# EAGLE design WIMOS-motherboard (EAGLE 7.7.0)
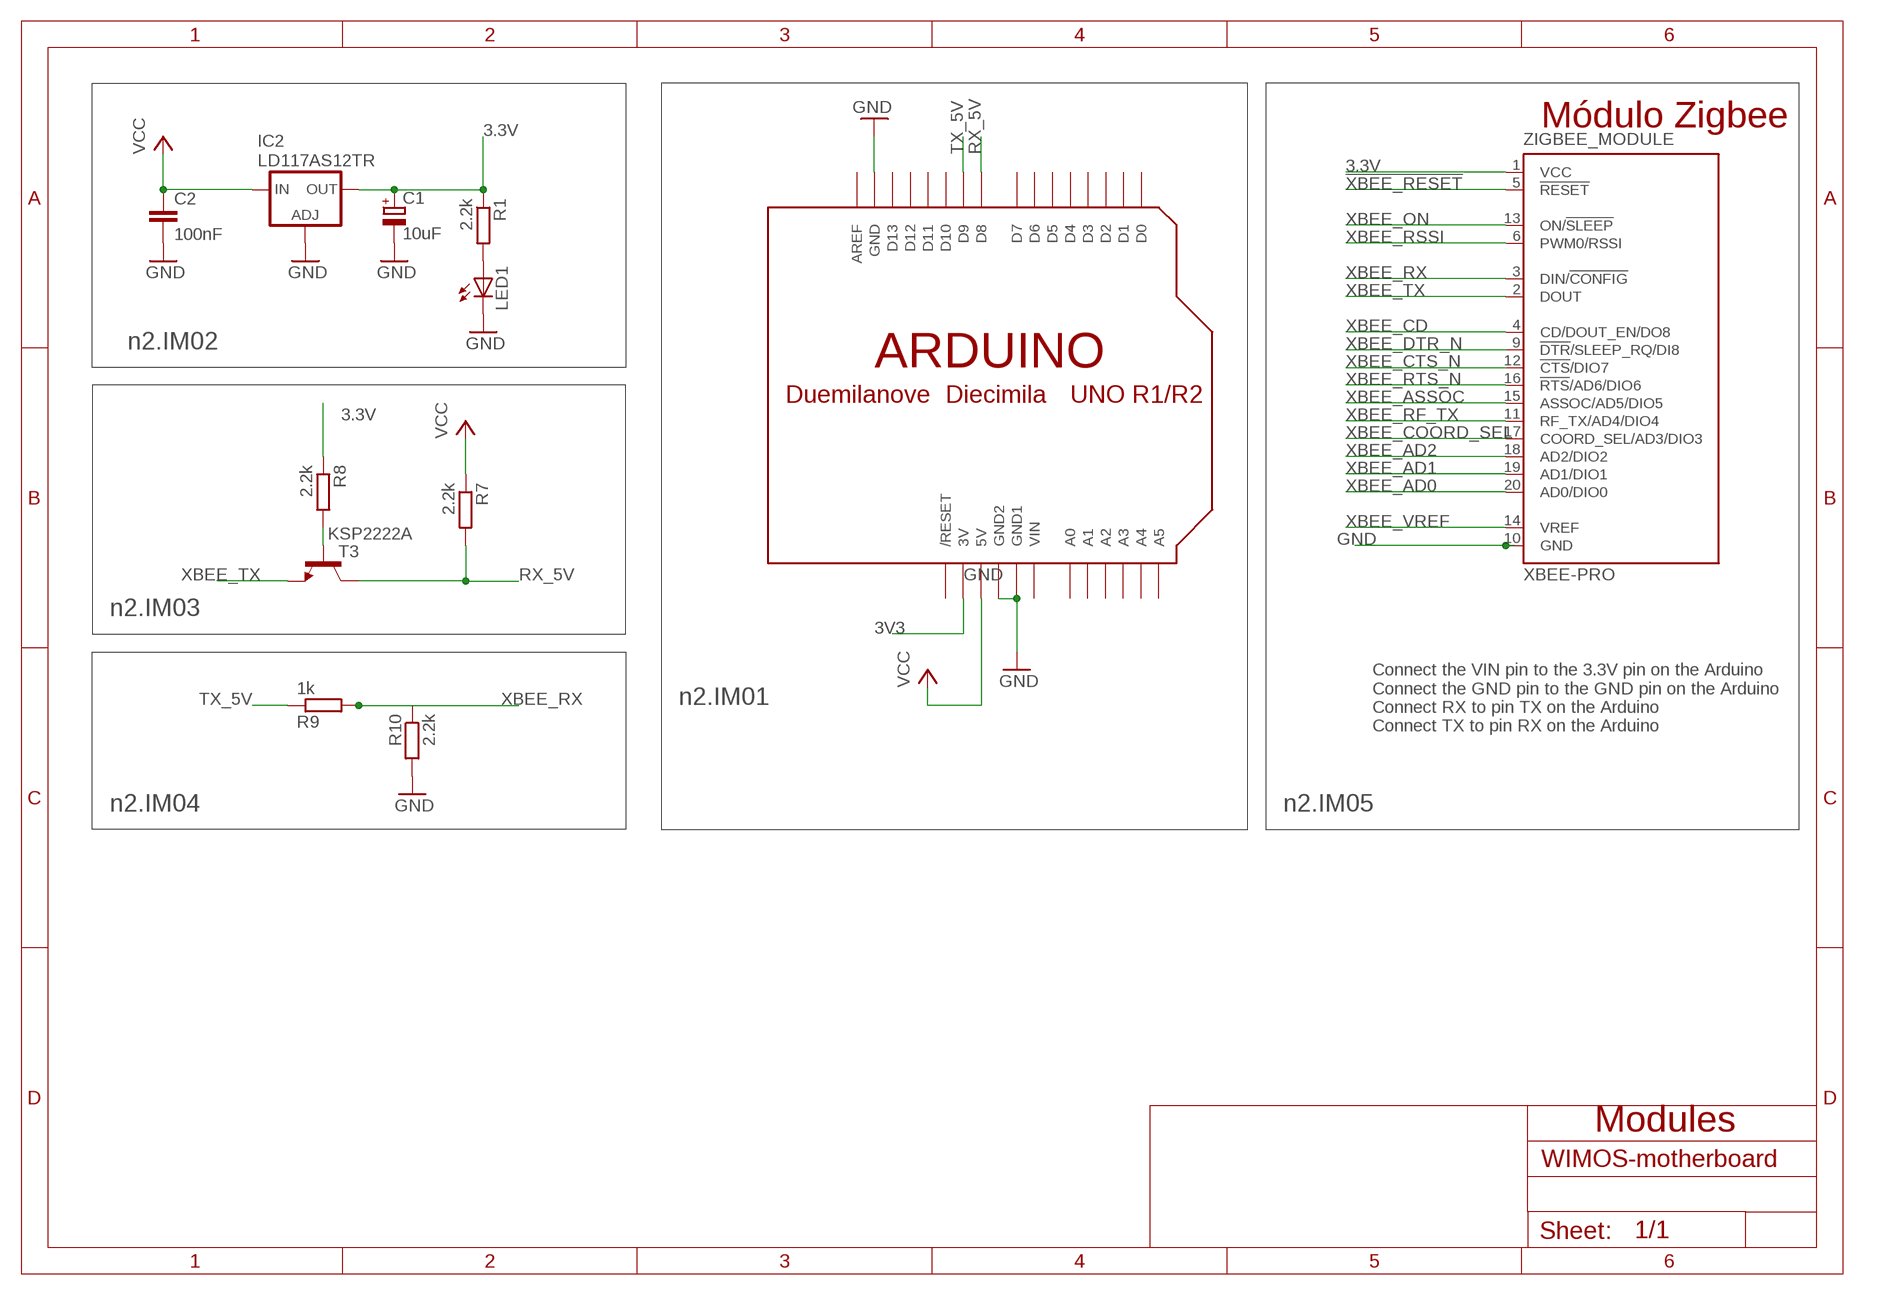
[diagram p0: schematic, sheet 1]

## Parts
C1  10uF  CPOL-EU153CLV-0810  [153CLV-0810]
C2  100nF  C-EUC0805K  [C0805K]
IC2  LD117AS12TR  [SOT223]
LED1  LED5MM  [LED5MM]
R1  2.2k  R-EU_R0805  [R0805]
R7  2.2k  R-EU_0204/5  [0204/5]
R8  2.2k  R-EU_0204/5  [0204/5]
R9  1k  R-EU_0204/5  [0204/5]
R10  2.2k  R-EU_0204/5  [0204/5]
T3  KSP2222A  MPS2222A-NPN-TO92-CBE  [TO92-CBE]
U$1  ARDUINO-NODIM  [ARDUINO-NODIM]
ZIGBEE_MODULE  XBEE-PRO  [XBEE-PRO]

## Nets
3.3V: C1.+ IC2.4(OUT) R1.1 R8.1 ZIGBEE_MODULE.1(VCC)
3V3: U$1.3V
!XBEE_RESET: ZIGBEE_MODULE.5(!RESET)
GND [gnd]: C1.- C2.2 IC2.1(ADJ) LED1.K(C) R10.2 U$1.GND U$1.GND1 U$1.GND2 ZIGBEE_MODULE.10(GND)
N$1: LED1.A R1.2
N$4: R8.2 T3.B
RX_5V: R7.2 T3.C U$1.D8
TX_5V: R9.1 U$1.D9
VCC: C2.1 IC2.3(IN) R7.1 U$1.5V
XBEE_AD0: ZIGBEE_MODULE.20(AD0/DIO0)
XBEE_AD1: ZIGBEE_MODULE.19(AD1/DIO1)
XBEE_AD2: ZIGBEE_MODULE.18(AD2/DIO2)
XBEE_ASSOC: ZIGBEE_MODULE.15(ASSOC/AD5/DIO5)
XBEE_CD: ZIGBEE_MODULE.4(CD/DOUT_EN/DO8)
XBEE_COORD_SEL: ZIGBEE_MODULE.17(COORD_SEL/AD3/DIO3)
XBEE_CTS_N: ZIGBEE_MODULE.12(!CTS!/DIO7)
XBEE_DTR_N: ZIGBEE_MODULE.9(!DTR!/SLEEP_RQ/DI8)
XBEE_ON: ZIGBEE_MODULE.13(ON/!SLEEP)
XBEE_RF_TX: ZIGBEE_MODULE.11(RF_TX/AD4/DIO4)
XBEE_RSSI: ZIGBEE_MODULE.6(PWM0/RSSI)
XBEE_RTS_N: ZIGBEE_MODULE.16(!RTS!/AD6/DIO6)
XBEE_RX: R9.2 R10.1 ZIGBEE_MODULE.3(DIN/!CONFIG)
XBEE_TX: T3.E ZIGBEE_MODULE.2(DOUT)
XBEE_VREF: ZIGBEE_MODULE.14(VREF)
Unconnected: U$1.A0 U$1.A1 U$1.A2 U$1.A3 U$1.A4 U$1.A5 U$1.AREF U$1.D0 U$1.D1 U$1.D2 U$1.D3 U$1.D4 U$1.D5 U$1.D6 U$1.D7 U$1.D10 U$1.D11 U$1.D12 U$1.D13 U$1.RESET(/RESET)

## Notes on the sheet
- Módulo Zigbee
- n2.IM02
- n2.IM03
- n2.IM01
- Connect the VIN pin to the 3.3V pin on the Arduino
  Connect the GND pin to the GND pin on the Arduino
  Connect RX to pin TX on the Arduino
  Connect TX to pin RX on the Arduino
- n2.IM04 | n2.IM05
- Modules

## Power pins joined to a net without a drawn wire
VIN: U$1.VIN

## Library data of the parts
C1 = rcl:CPOL-EU: POLARIZED CAPACITOR, European symbol
C2 = resistor:C-EU: CAPACITOR, European symbol
IC2 = v-reg:LD117A?*: Low drop fixed and adjustable positive voltage regulators 1 A Source: http://www.st.com/stonline/products/literature/ds/7194/ld1117axx.pdf
LED1 = led:LED: LED OSRAM: - CHIPLED LG R971, LG N971, LY N971, LG Q971, LY Q971, LO R971, LY R971 LH N974, LH R974 LS Q976, LO Q976, LY Q976 LO Q996 - Hyper CHIPLED LW Q18S LB Q993, LB Q99A, LB R99A - SideLED LS A670, LO A670, LY A670, LG A670, LP A670 LB A673, LV A673, LT A673, LW A673 LH A674 LY A675 LS A676, LA A676, LO A676, LY A676, LW A676 LS A679, LY A679, LG A679 - Hyper Micro SIDELED® LS Y876, LA Y876, LO Y876, LY Y876 LT Y87S - SmartLED LW L88C, LW L88S LB L89C, LB L89S, LG L890 LS L89K, LO L89K, LY L89K LS L896, LA L896, LO L896, LY L896 - TOPLED LS T670, LO T670, LY T670, LG T670, LP T670 LSG T670, LSP T670, LSY T670, LOP T670, LYG T670 LG T671, LOG T671, LSG T671 LB T673, LV T673, LT T673, LW T673 LH T674 LS T676, LA T676, LO T676, LY T676, LB T676, LH T676, LSB T676, LW T676 LB T67C, LV T67C, LT T67C, LS T67K, LO T67K, LY T67K, LW E67C LS E67B, LA E67B, LO E67B, LY E67B, LB E67C, LV E67C, LT E67C LW T67C LS T679, LY T679, LG T679 LS T770, LO T770, LY T770, LG T770, LP T770 LB T773, LV T773, LT T773, LW T773 LH T774 LS E675, LA E675, LY E675, LS T675 LS T776, LA T776, LO T776, LY T776, LB T776 LHGB T686 LT T68C, LB T68C - Hyper Mini TOPLED® LB M676 - Mini TOPLED Santana® LG M470 LS M47K, LO M47K, LY M47K Source: http://www.osram.convergy.de LUXEON: - LUMILED® LXK2-PW12-R00, LXK2-PW12-S00, LXK2-PW14-U00, LXK2-PW14-V00 LXK2-PM12-R00, LXK2-PM12-S00, LXK2-PM14-U00 LXK2-PE12-Q00, LXK2-PE12-R00, LXK2-PE12-S00, LXK2-PE14-T00, LXK2-PE14-U00 LXK2-PB12-K00, LXK2-PB12-L00, LXK2-PB12-M00, LXK2-PB14-N00, LXK2-PB14-P00, LXK2-PB14-Q00 LXK2-PR12-L00, LXK2-PR12-M00, LXK2-PR14-Q00, LXK2-PR14-R00 LXK2-PD12-Q00, LXK2-PD12-R00, LXK2-PD12-S00 LXK2-PH12-R00, LXK2-PH12-S00 LXK2-PL12-P00, LXK2-PL12-Q00, LXK2-PL12-R00 Source: www.luxeon.com KINGBRIGHT: KA-3528ASYC Source: www.kingbright.com
R1 R7-R10 = rcl:R-EU_: RESISTOR, European symbol
T3 = transistor:*-NPN-: NPN Transistror BF959 corrected 2008.03.06
U$1 = adafruit:ARDUINO: Arduino Diecimila/Duemilanove Make a shield with ease, this package has all the named pins as well as the two mounting drill holes and an outline of the USB and DC power connector. The outline is on the DIMENSION layer, so if your board house uses it they will cut the outline to match. http://www.ladyada.net/library/pcb/eaglelibrary.html
ZIGBEE_MODULE = maxstream:XBEE: XBee (TM) /XBee-PRO(TM) OEM RF Modules Source: MaxStream, Inc. xbee_productmanual.pdf; MPN: XBP24-AWI-001; OC_FARNELL: 1337916; OC_NEWARK: 42M2667

## Module INPUT
Ports: 

### Library data of the parts

## Net classes
0 default: width 0.203 mm, drill 0.406 mm, clearance 0.203 mm
1 USB: width 0.203 mm, drill 0.406 mm, clearance 0.203 mm
2 gnd: width 0.203 mm, drill 0.406 mm, clearance 0.203 mm
3 usbvcc: width 0.203 mm, drill 0.406 mm, clearance 0.203 mm
4 USBpair: width 0.254 mm, drill 0.406 mm, clearance 0.61 mm

## Board
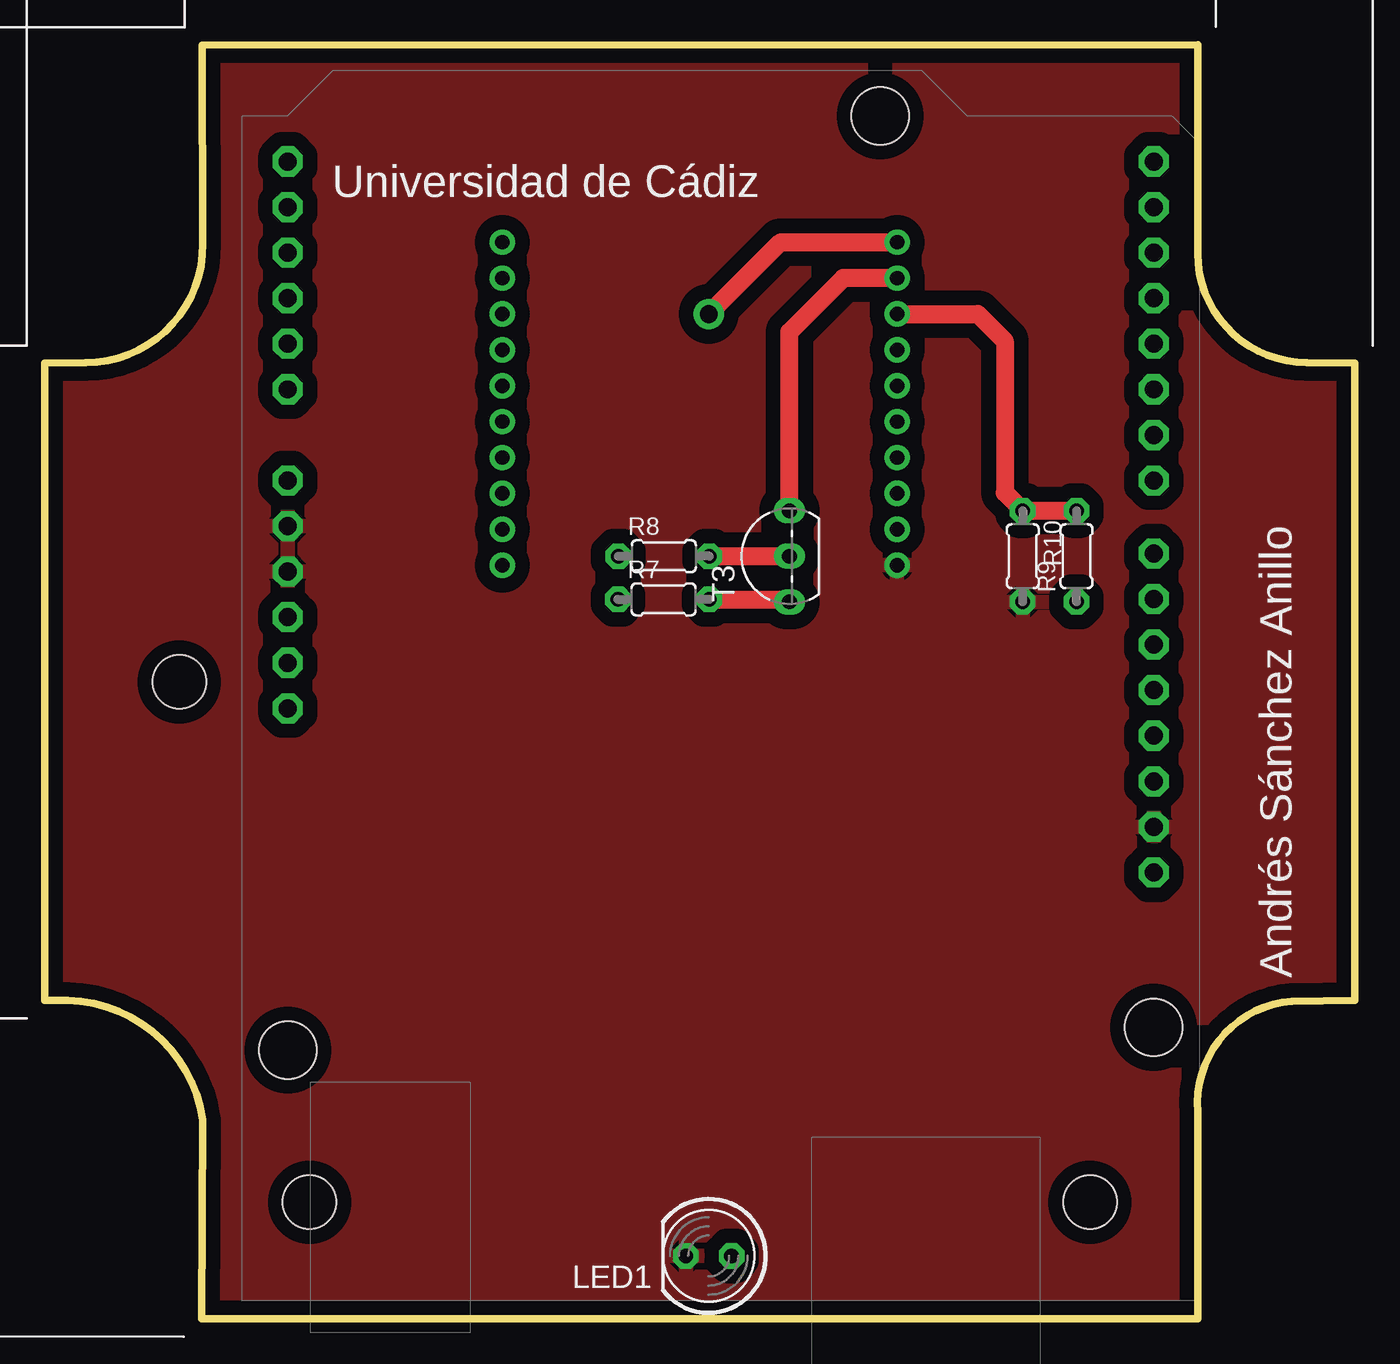
[diagram p1: board, top side]
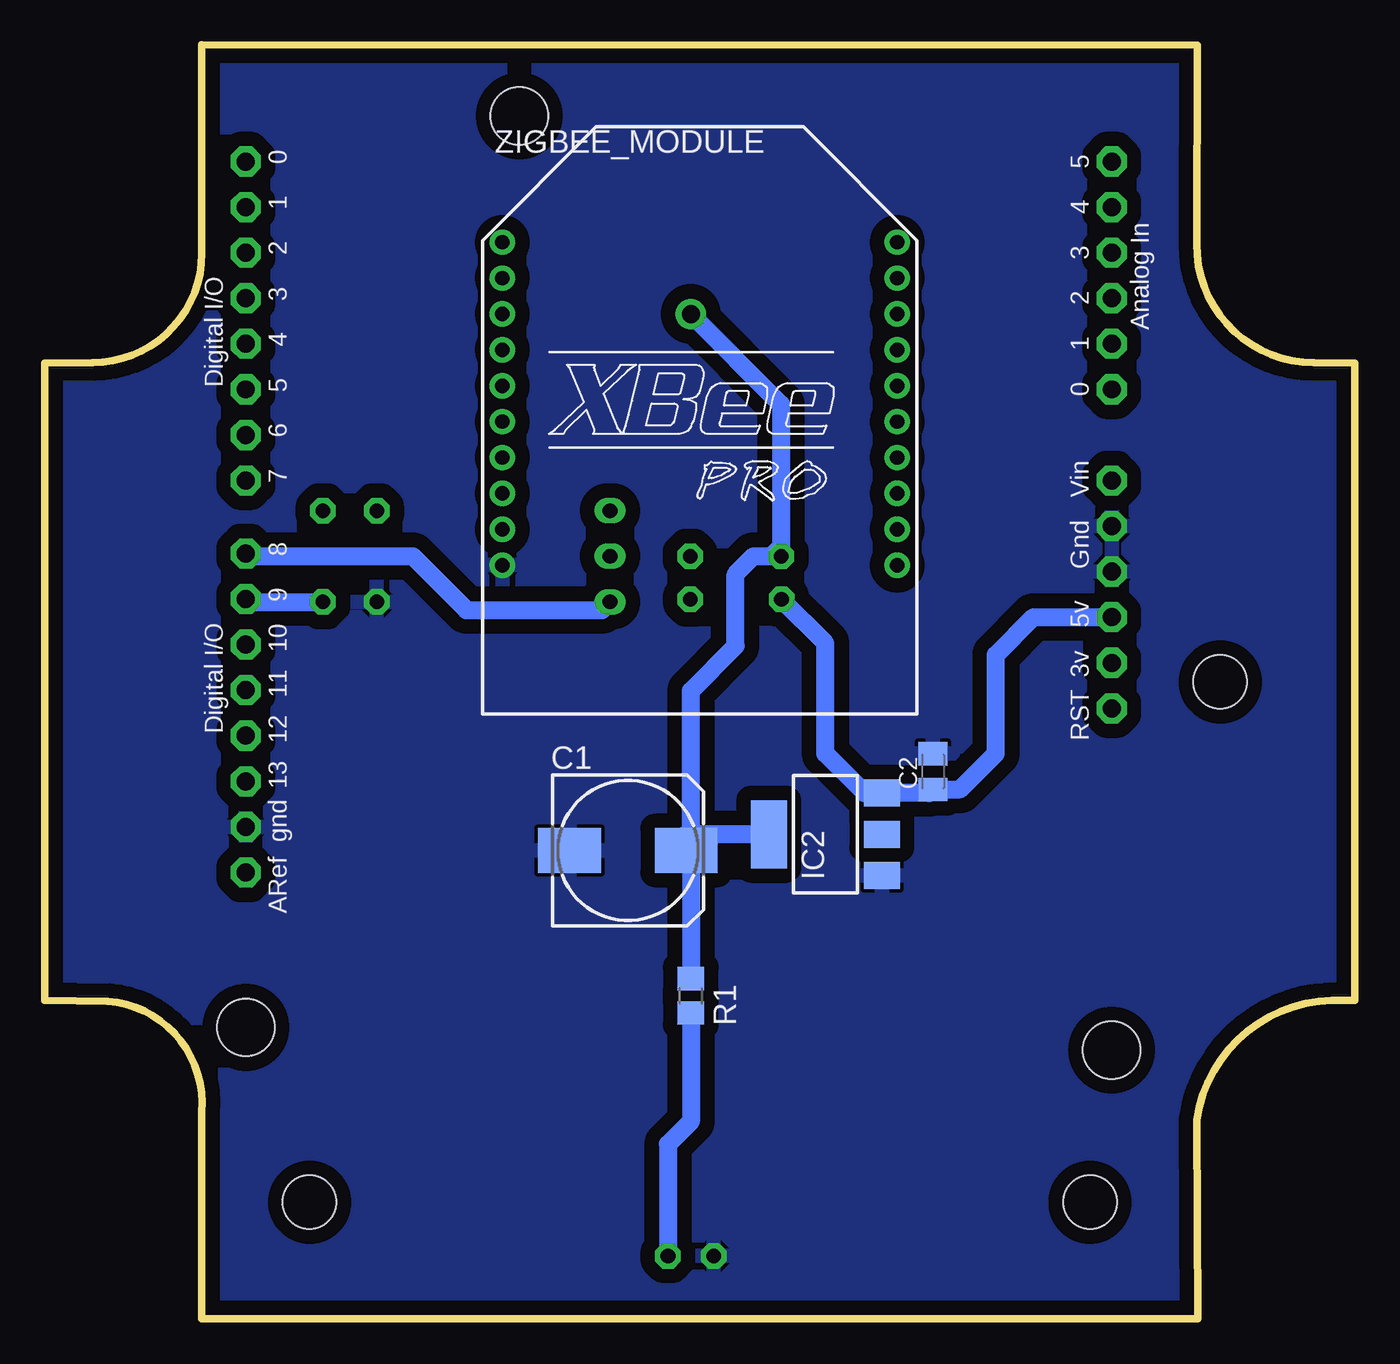
[diagram p2: board, bottom side, seen from below]

Size 73 x 71 mm. Coordinates in mm from the lower left corner, seen from the top.
Outline: 8.75,0 64.25,0 64.25,11.53 arc-90 69.5,17.7 73,17.75 73,53.25 70.33,53.3 arc-90 64.25,59.38 64.25,71 8.78,70.98 8.8,59.9 arc-91 2.29,53.3 0,53.25 0,17.75 arc-4 0.56,17.73 arc-85 8.8,11.09 8.75,0
Copper layers (1*16): Top 0.035mm / dielectric 1.6mm / Bottom 0.035mm
Design rules "default *": minimum track width 8mil, minimum drill 16mil, track to track 8mil, track to pad 8mil, pad to pad 8mil, via to via 8mil, smd to smd 6mil, copper to edge 20mil, drill to drill 12mil, minimum pad ring 12mil, minimum via ring 8mil, stop-mask expansion 2mil, vias tented up to drill 25mil, thermal gap 8mil
Holes 3 mm at 7.5,35.5 58.25,6.5 14.75,6.5

### Footprints (pad centres in the part's own frame; a part is rotated, then mirrored left to right if it is on the bottom)
153CLV-0810 = smd 3.5 x 2.5: + 3.25,0; - -3.25,0
C0805K = smd 1.3 x 1.6: 1 -1,0; 2 1,0
SOT223 = smd 1.5 x 2: 1 -2.3,-3.15; 2 0,-3.15; 3 2.3,-3.15 | smd 3.8 x 2: 4 0,3.15
LED5MM = drill 0.813 octagon: A -1.27,0; K 1.27,0
R0805 = smd 1.3 x 1.5: 1 -0.95,0; 2 0.95,0
0204/5 = drill 0.813 octagon: 1 -2.54,0; 2 2.54,0
TO92-CBE = drill 0.813 long: B 0,0; C -2.54,0; E 2.54,0
ARDUINO-NODIM = drill 1 pad 1.676 octagon: 3V 35.56,2.54; 5V 38.1,2.54; A0 50.8,2.54; A1 53.34,2.54; A2 55.88,2.54; A3 58.42,2.54; A4 60.96,2.54; A5 63.5,2.54; AREF 23.876,50.8; D0 63.5,50.8; D1 60.96,50.8; D2 58.42,50.8; D3 55.88,50.8; D4 53.34,50.8; D5 50.8,50.8; D6 48.26,50.8; D7 45.72,50.8; D8 41.656,50.8; D9 39.116,50.8; D10 36.576,50.8; D11 34.036,50.8; D12 31.496,50.8; D13 28.956,50.8; GND 26.416,50.8; GND1 43.18,2.54; GND2 40.64,2.54; RESET 33.02,2.54; VIN 45.72,2.54 | hole 3.2: 15.24,50.8; 66.04,35.56; 13.97,2.54
XBEE-PRO = drill 0.8 pad 1.27: 1 -11,9; 2 -11,7; 3 -11,5; 4 -11,3; 5 -11,1; 6 -11,-1; 7 -11,-3; 8 -11,-5; 9 -11,-7; 10 -11,-9; 11 11,-9; 12 11,-7; 13 11,-5; 14 11,-3; 15 11,-1; 16 11,1; 17 11,3; 18 11,5; 19 11,7; 20 11,9

### Placement (x,y rotation side)
C1  40.5,26.1 0 bottom
C2  23.5,30.5 90 bottom
IC2  29.5,27 90 bottom
LED1  37,3.5 180 top
R1  37,18 270 bottom
R7  34.48,40.09 0 top
R8  34.5,42.5 0 top
R9  57.5,42.5 90 top
R10  54.5,42.5 270 top
T3  41.5,42.5 90 top
U$1  11,1 90 bottom
ZIGBEE_MODULE  36.5,51 0 bottom

### Tracks (layer width: path | path; a pad name or v marks a point on that pad's centre or on a via)
3.3V  (via drill 1 pad 1.68)
  Top 1.016: v37,56 41,60 ZIGBEE_MODULE.1
  Bottom 0.406: C1.+ 37.17,26.1 37.17,26.93
  Bottom 1.016: IC2.4 37.25,27 | 37.25,27 37.17,26.93 37,26.75 R1.1 | 37.25,27 37,27.25 37,35 34.5,37.5 34.5,41.5 33.5,42.5 32.5,42.5 | v37,56 31.96,50.96 31.96,43.04 32.5,42.5 | 32.5,42.5 R8.1
GND
  pour Top (isolate 0.813): -14.5,75.5 -14.5,-4.5 84.5,-5.5 85.5,75.5
  pour Bottom (isolate 0.813): -14.5,75.5 -14.5,-5.5 85.5,-6.5 85.5,74.5
N$1
  Bottom 1.016: R1.2 37,11 38.27,9.73 LED1.A
N$4
  Top 1.016: R8.2 T3.B
RX_5V
  Top 1.016: R7.2 41.37,40.09 T3.C
  Bottom 1.016: T3.C 41.96,39.5 49.5,39.5 52.5,42.5 61.64,42.5 U$1.D8
TX_5V
  Bottom 1.016: R9.1 61.64,39.96 U$1.D9
VCC
  Bottom 1.016: U$1.5V 17.9,39.1 20,37 20,31.5 22,29.5 C2.1 23.7,29.3 IC2.3 27.3,29.3 29.5,31.5 29.5,37.65 R7.1
XBEE_RX
  Top 1.016: ZIGBEE_MODULE.3 52,56 53.5,54.5 53.5,46.04 R10.1 R9.2
XBEE_TX
  Top 1.016: ZIGBEE_MODULE.2 44.5,58 41.5,55 T3.E

### Text on the board
tPlace: Universidad de Cádiz | Andrés Sánchez Anillo